# Altium schematic sheet Intercomm_sheet_3.SchDoc
size 209 x 297 mm; SheetNumber: 2; SheetTotal: 2
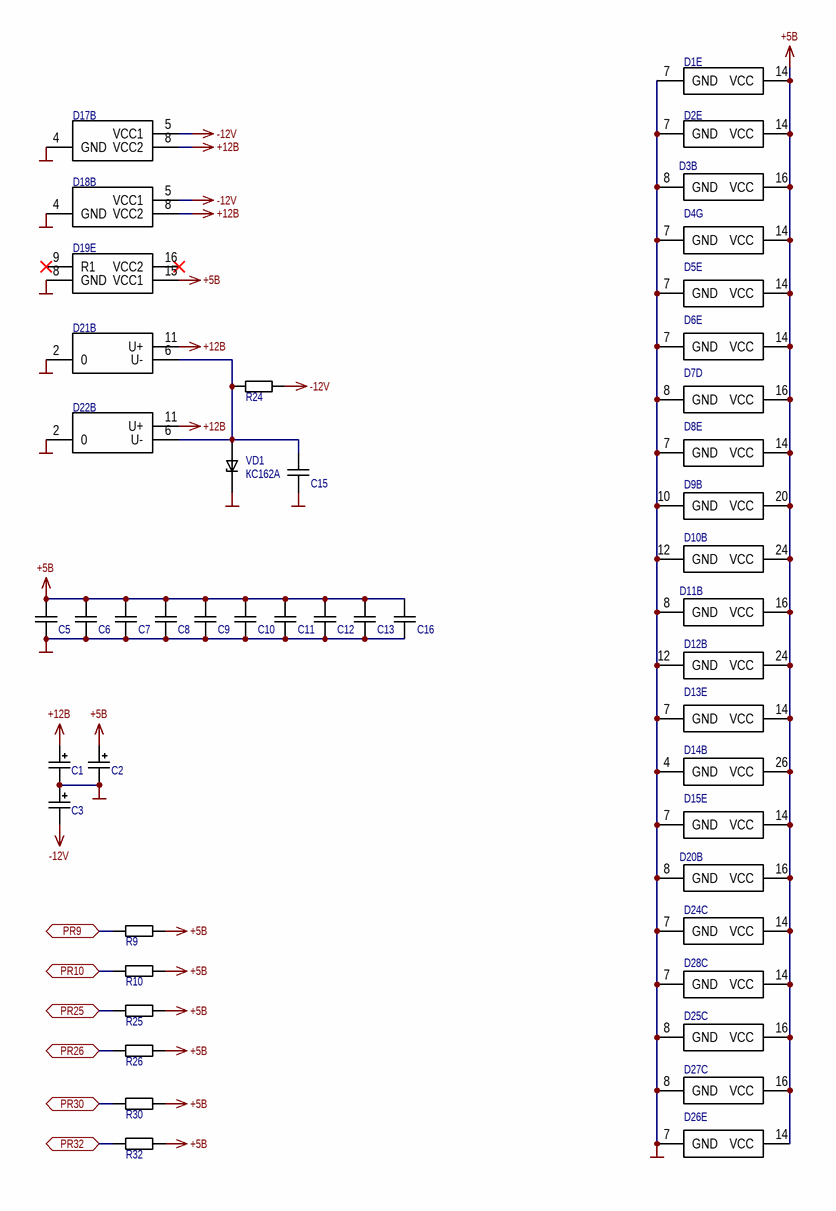
[diagram p0: Intercomm_sheet_3.SchDoc]

## Parts
C1  0,1  [CP25]  (value not drawn)
C2  0,1  [CP25]  (value not drawn)
C3  0,1  [CP25]  (value not drawn)
C5  0,1  [C5]  (value not drawn)
C6  0,1  [C5]  (value not drawn)
C7  0,1  [C5]  (value not drawn)
C8  0,1  [C5]  (value not drawn)
C9  0,1  [C5]  (value not drawn)
C10  0,1  [C5]  (value not drawn)
C11  0,1  [C5]  (value not drawn)
C12  0,1  [C5]  (value not drawn)
C13  0,1  [C5]  (value not drawn)
C15  0,1  [C5]  (value not drawn)
C16  0,1  [C5]  (value not drawn)
D1  К555ЛП8  [201.14]  (value not drawn)  (part E of 5)
D2  К555ЛП8  [201.14]  (value not drawn)  (part E of 5)
D3  К555ИД4  [201.16]  (value not drawn)  (part B of 2)
D4  К555ТЛ2  [201.14]  (value not drawn)  (part G of 7)
D5  К555ЛИ1  [201.14]  (value not drawn)  (part E of 5)
D6  К555ЛА3  [201.14]  (value not drawn)  (part E of 5)
D7  КР559ИП7  [201.16]  (value not drawn)  (part D of 4)
D8  К555ЛЕ1  [201.14]  (value not drawn)  (part E of 5)
D9  КР580ВА86  [2140.20]  (value not drawn)  (part B of 2)
D10  К573РФ2  [2120.24 socket]  (value not drawn)  (part B of 2)
D11  К555КП11  [201.16]  (value not drawn)  (part B of 2)
D12  КР580ВИ53  [2120.24]  (value not drawn)  (part B of 2)
D13  К555ЛП8  [201.14]  (value not drawn)  (part E of 5)
D14  КР580ВВ51А  [2121.28]  (value not drawn)  (part B of 2)
D15  К555ЛЕ1  [201.14]  (value not drawn)  (part E of 5)
D17  К170АП2  [2101.8]  (value not drawn)  (part B of 2)
D18  К170АП2  [2101.8]  (value not drawn)  (part B of 2)
D19  К170УП2  [201.16]  (value not drawn)  (part E of 5)
D20  К555КП11  [201.16]  (value not drawn)  (part B of 2)
D21  К554СА2  [201.14]  (value not drawn)  (part B of 2)
D22  К554СА2  [201.14]  (value not drawn)  (part B of 2)
D24  К555ТМ2  [201.14]  (value not drawn)  (part C of 3)
D25  К155АГ3  [201.16]  (value not drawn)  (part C of 3)
D26  К555ЛА3  [201.14]  (value not drawn)  (part E of 5)
D27  К155АГ3  [201.16]  (value not drawn)  (part C of 3)
D28  К555ТМ2  [201.14]  (value not drawn)  (part C of 3)
R9  1K  [R10]  (value not drawn)
R10  1K  [R10]  (value not drawn)
R24  1K  [R10]  (value not drawn)
R25  1K  [R10]  (value not drawn)
R26  1K  [R10]  (value not drawn)
R30  1K  [R10]  (value not drawn)
R32  1K  [R10]  (value not drawn)
VD1  КС162А  [КД-25]

## Ports
PR9 (bidir, see Intercomm_sheet_1[1B], Intercomm_sheet_1[3B], Intercomm_sheet_1[3C]), PR10 (bidir, see Intercomm_sheet_1[1D], Intercomm_sheet_1[2D]), PR25 (bidir, see Intercomm_sheet_1[1B], Intercomm_sheet_1[2C]), PR26 (bidir, see Intercomm_sheet_1[2B]), PR30 (bidir, see Intercomm_sheet_1[1C], Intercomm_sheet_1[2A]), PR32 (bidir, see Intercomm_sheet_1[4A])

## Nets
+5В: C2.1 C5.1 C6.1 C7.1 C8.1 C9.1 C10.1 C11.1 C12.1 C13.1 C16.1 D1.14(VCC) D2.14(VCC) D3.16(VCC) D4.14(VCC) D5.14(VCC) D6.14(VCC) D7.16(VCC) D8.14(VCC) D9.20(VCC) D10.24(VCC) D11.16(VCC) D12.24(VCC) D13.14(VCC) D14.26(VCC) D15.14(VCC) D19.15(VCC1) D20.16(VCC) D24.14(VCC) D25.16(VCC) D26.14(VCC) D27.16(VCC) D28.14(VCC) R9.2 R10.2 R25.2 R26.2 R30.2 R32.2
+12В: C1.1 D17.8(VCC2) D18.8(VCC2) D21.11(U+) D22.11(U+)
-12V: C3.2 D17.5(VCC1) D18.5(VCC1) R24.1
GND: C1.2 C2.2 C3.1 C5.2 C6.2 C7.2 C8.2 C9.2 C10.2 C11.2 C12.2 C13.2 C15.1 C16.2 D1.7(GND) D2.7(GND) D3.8(GND) D4.7(GND) D5.7(GND) D6.7(GND) D7.8(GND) D8.7(GND) D9.10(GND) D10.12(GND) D11.8(GND) D12.12(GND) D13.7(GND) D14.4(GND) D15.7(GND) D17.4(GND) D18.4(GND) D19.8(GND) D20.8(GND) D21.2(0) D22.2(0) D24.7(GND) D25.8(GND) D26.7(GND) D27.8(GND) D28.7(GND) VD1.2
PR9: R9.1 ; port PR9
PR10: R10.1 ; port PR10
PR25: R25.1 ; port PR25
PR26: R26.1 ; port PR26
PR30: R30.1 ; port PR30
PR32: R32.1 ; port PR32
NetC15_2: C15.2 D21.6(U-) D22.6(U-) R24.2 VD1.1

Not connected (* = marked no-connect by the designer): D19 9(R1)* 16(VCC2)*

## Notes on the sheet
- Перв. примен.
- Справ. №
- Подп. и дата
- Инв. № дубл.
- Взам. инв. №
- Разраб.
- Изм.
- Лист
- № докум.
- Подп.
- Дата
- Лит.
- Масса
- Масштаб
- Пров.
- Т.контр.
- Листов
- Инв. № подл.
- Утв.
- Н.контр.
- 2.106-A4
- Копировал
- Формат А4

## Library data of the parts
C1-C3 = К53-14: Value: 0,1
C5-C13 C15 C16 = К10-17: Value: 0,1
D7 = КР559ИП7: ManufacturerPartNumber: К555ЛА3
D8 D15 = К555ЛЕ1: ManufacturerPartNumber: К555ЛА3
D9 = КР580ВА86_1
R9 R10 R24-R26 R30 R32 = С2-23: Резистор; Value: 1K
D3 = К555ИД4: ManufacturerPartNumber: К555ИД4
D5 = К555ЛИ1: ManufacturerPartNumber: К555ЛИ1
D6 D26 = К555ЛА3: ManufacturerPartNumber: К555ЛА3
D11 D20 = К555КП11: ManufacturerPartNumber: К555КП11